# Altium schematic sheet 1_Power.SchDoc
size A4
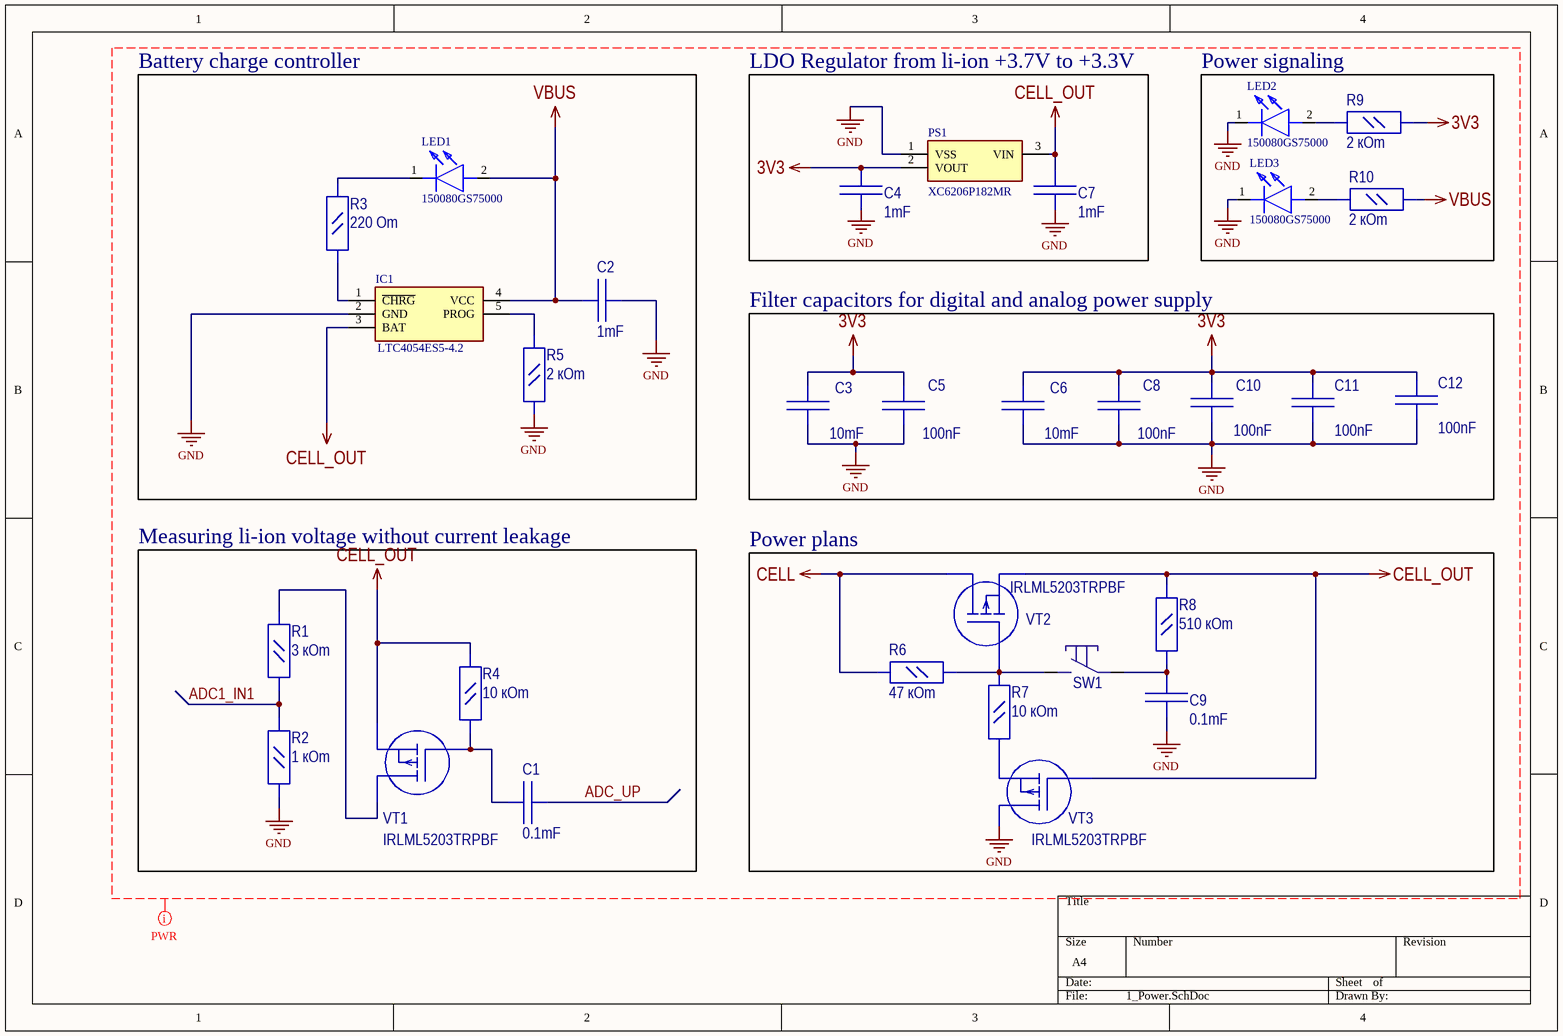
[diagram p0: 1_Power.SchDoc]

## Parts
C1  0.1mF  [C_0805]
C2  1mF  [C_0805]
C3  10mF  [C_0805]
C4  1mF  [C_0805]
C5  100nF  [C_0805]
C6  10mF  [C_0805]
C7  1mF  [C_0805]
C8  100nF  [C_0805]
C9  0.1mF  [C_0805]
C10  100nF  [C_0805]
C11  100nF  [C_0805]
C12  100nF  [C_0805]
IC1  LTC4054ES5-4.2  [SOT95P280X100-5N]
LED1  150080GS75000  [LEDM2012X80N]
LED2  150080GS75000  [LEDM2012X80N]
LED3  150080GS75000  [LEDM2012X80N]
PS1  XC6206P182MR  [SOT95P280X130-3N]
R1  3 кOm  [R_0805]
R2  1 кOm  [R_0805]
R3  220 Om  [R_0805]
R4  10 кOm  [R_0805]
R5  2 кOm  [R_0805]
R6  47 кOm  [R_0805]
R7  10 кOm  [R_0805]
R8  510 кOm  [R_0805]
R9  2 кOm  [R_0805]
R10  2 кOm  [R_0805]
SW1  KLS7-TS6604  [KLS7-TS6604-5.0-180-B]  (value not drawn)
VT1  IRLML5203TRPBF  [SOT23]
VT2  IRLML5203TRPBF  [SOT23]
VT3  IRLML5203TRPBF  [SOT23]

## Blocks framed on the sheet
Battery charge controller: C2 IC1 LED1 R3 R5
LDO Regulator from li-ion +3.7V to +3.3V: C4 C7 PS1
Power signaling: LED2 LED3 R9 R10
Filter capacitors for digital and analog power supply: C3 C5 C6 C8 C10-C12
Measuring li-ion voltage without current leakage: C1 R1 R2 R4 VT1
Power plans: C9 R6-R8 SW1 VT2 VT3

## Nets
3V3: C3.2 C4.2 C5.2 C6.2 C8.2 C10.2 C11.2 C12.2 PS1.2(VOUT) R9.1
CELL: R6.2 VT2.3(D)
CELL_OUT: C7.2 IC1.3(BAT) PS1.3(VIN) R4.2 R8.2 VT1.2(S) VT2.2(S) VT3.1(G)
GND: C2.2 C3.1 C4.1 C5.1 C6.1 C7.1 C8.1 C9.1 C10.1 C11.1 C12.1 IC1.2(GND) LED2.1(K) LED3.1(K) PS1.1(VSS) R2.1 R5.1
VBUS: C2.1 IC1.4(VCC) LED1.2(A) R10.1
ADC1_IN1: R1.1 R2.2
ADC_UP: C1.1
NetC1_2: C1.2 R4.1 VT1.1(G)
NetC9_2: C9.2 R8.1 SW1.2
NetIC1_1: IC1.1(~{CHRG}) R3.1
NetIC1_5: IC1.5(PROG) R5.2
NetLED1_1: LED1.1(K) R3.2
NetLED2_2: LED2.2(A) R9.2
NetLED3_2: LED3.2(A) R10.2
NetR1_2: R1.2 VT1.3(D)
NetR6_1: R6.1 R7.2 SW1.1 VT2.1(G)
NetR7_1: R7.1 VT3.2(S)

Not connected (* = marked no-connect by the designer): VT3 3(D)

## Layout directives
net class PWR: 3V3, ADC1_IN1, ADC_UP, CELL, CELL_OUT, GND, VBUS

## Notes on the sheet
- Labels drawn without touching a wire or pin: GND

## Library data of the parts
C1-C12 = C_0805
  C1 C9: Value: 0.1mF
  C2 C4 C7: Value: 1mF
  C3 C6: Value: 10mF
  C5 C8 C10-C12: Value: 100nF
IC1 = LTC4054ES5-4.2: Integrated Circuit; Manufacturer_Name: Linear Technology; Datasheet Link: https://componentsearchengine.com/Datasheets/1/LTC4054ES5-4.2.pdf; Height: 1mm; Manufacturer_Part_Number: LTC4054ES5-4.2; Mouser Part Number: 584-LTC4054ES5-4.2; Mouser Price/Stock: https://www.mouser.com/Search/Refine.aspx?Keyword=584-LTC4054ES5-4.2
LED1-LED3 = 150080GS75000: LED; Manufacturer_Name: Wurth Elektronik; Datasheet Link: https://katalog.we-online.com/led/datasheet/150080GS75000.pdf; Height: 0.8mm; Manufacturer_Part_Number: 150080GS75000; Mouser Part Number: 710-150080GS75000; Mouser Price/Stock: https://www.mouser.co.uk/ProductDetail/Wurth-Elektronik/150080GS75000?qs=2kOmHSv6VfQRoTEZVk1mGA%3D%3D
PS1 = XC6206P182MR: Power Supply; Manufacturer_Name: Torex; Datasheet Link: https://componentsearchengine.com/Datasheets/2/XC6206P182MR.pdf; Height: 1.3mm; Manufacturer_Part_Number: XC6206P182MR
R1 R4 R7 = R_0805: Value: 10 kOm
R2 = R_0805: Value: 1 kOm
R3 = R_0805: Value: 220 Om
R5 R9 R10 = R_0805: Value: 2 kOm
R6 = R_0805: Value: 47 kOm
R8 = R_0805: Value: 510 kOm
VT1-VT3 = IRLML5203TRPBF: Транзистор, P-канал 30В 3A logic